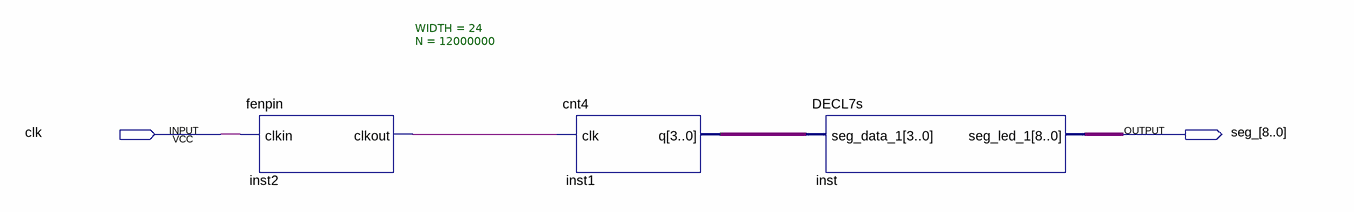
[diagram p0: schematic sheet]
// Quartus schematic Block1.bdf as structural Verilog: 3 symbols, 2 pins
module Block1 (
  input  clk,
  output [8:0] seg_
);

  wire inst2_clkout;
  wire [3:0] inst1_q;

  fenpin #(.WIDTH(24), .N(12000000)) inst2 (.clkin(clk), .clkout(inst2_clkout));
  cnt4 inst1 (.clk(inst2_clkout), .q(inst1_q));
  DECL7s inst (.seg_data_1(inst1_q), .seg_led_1(seg_));
endmodule
